# EAGLE design teensy_can (EAGLE 6.4)
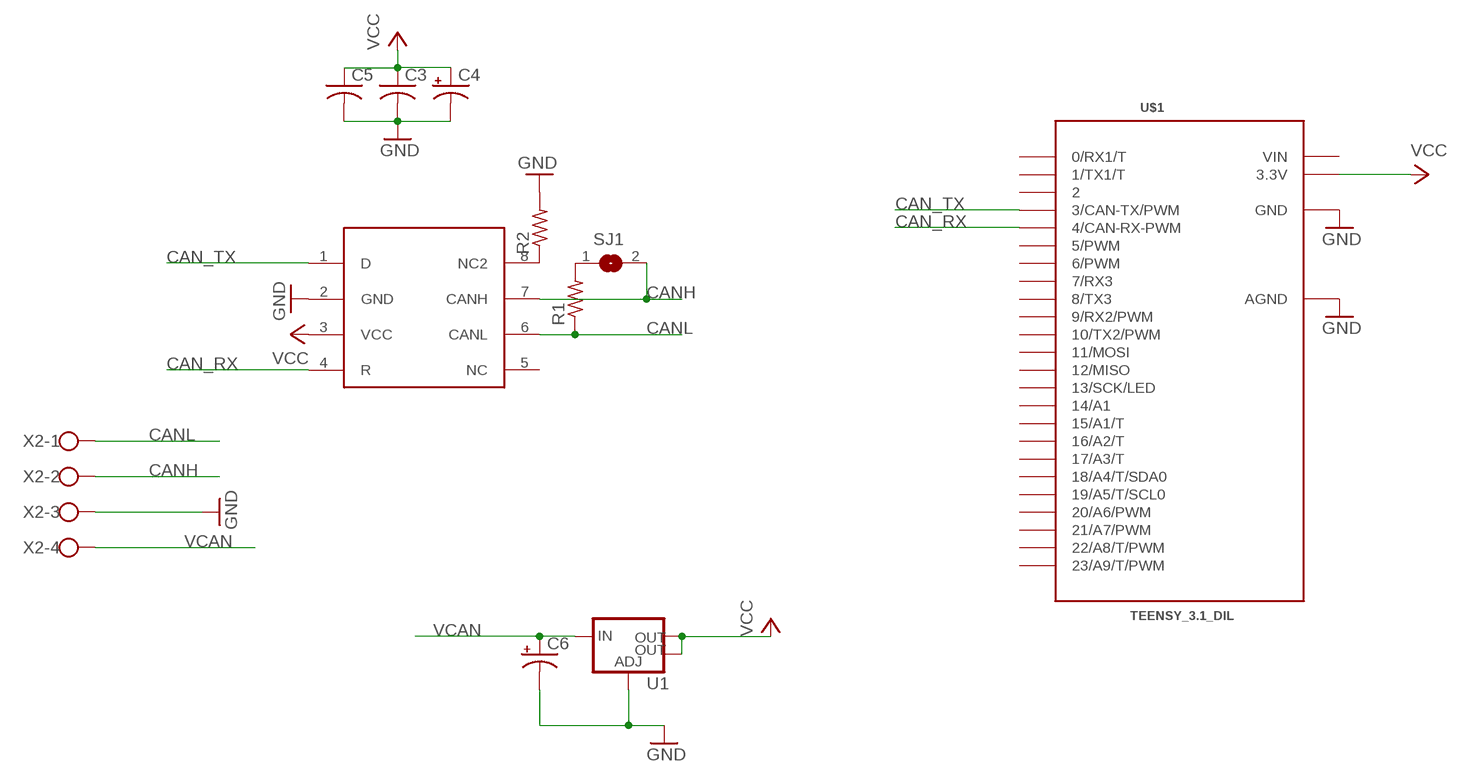
[diagram p0: schematic, sheet 1]

## Parts
C3  C-USC0805K  [C0805K]
C4  CPOL-USA/3216-18R  [A/3216-18R]
C5  C-USC0805K  [C0805K]
C6  CPOL-USA/3216-18R  [A/3216-18R]
R1  R-US_R0805  [R0805]
R2  R-US_R0805  [R0805]
SJ1  SJ  [SJ]
U1  V_REG_LM1117SOT223  [SOT223]
U$1  TEENSY_3.1_DIL  [TEENSY3-DIL]
U$2  SN65HVD232  [SO08-SKINNYPADS]
X2  W237-4  [W237-4]

## Nets
CAN_RX: U$1.4(4/CAN-RX-PWM) U$2.4(R)
CAN_TX: U$1.3(3/CAN-TX/PWM) U$2.1(D)
CANH: SJ1.2 U$2.7(CANH) X2.2
CANL: R1.1 U$2.6(CANL) X2.1
GND: C3.2 C4.- C5.2 C6.- R2.2 U1.1(ADJ) U$1.AGND U$1.GND U$2.2(GND) X2.3
N$1: R1.2 SJ1.1
N$3: R2.1 U$2.8(NC2)
VCAN: C6.+ U1.3(IN) X2.4
VCC: C3.1 C4.+ C5.1 U1.2(OUT) U1.4(OUT) U$1.3.3V U$2.3(VCC)
Unconnected: U$1.0(0/RX1/T) U$1.1(1/TX1/T) U$1.2 U$1.5(5/PWM) U$1.6(6/PWM) U$1.7(7/RX3) U$1.8(8/TX3) U$1.9(9/RX2/PWM) U$1.10(10/TX2/PWM) U$1.11(11/MOSI) U$1.12(12/MISO) U$1.13(13/SCK/LED) U$1.14/A0(14/A1) U$1.15/A1(15/A1/T) U$1.16/A2(16/A2/T) U$1.17/A3(17/A3/T) U$1.18/A4(18/A4/T/SDA0) U$1.19/A5(19/A5/T/SCL0) U$1.20/A6(20/A6/PWM) U$1.21/A7(21/A7/PWM) U$1.22/A8(22/A8/T/PWM) U$1.23/A9(23/A9/T/PWM) U$2.5(NC)

## Power pins joined to a net without a drawn wire
VIN: U$1.VIN

## Library data of the parts
C3 C5 = adafruit:C-US: CAPACITOR, American symbol
C4 C6 = adafruit:CPOL-US: POLARIZED CAPACITOR, American symbol
R1 R2 = adafruit:R-US_: RESISTOR, American symbol
SJ1 = jumper:SJ: SMD solder JUMPER
U1 = SparkFun-PowerIC:V_REG_LM1117: Voltage Regulator LM1117 Standard adjustable voltage regulator but in SMD form. Spark Fun Electronics SKU : COM-00595; PROD_ID: VREG-08170
U$1 = Teensy_3_and_LC_Series_Boards_v1.1:TEENSY_3.1_DIL: Teensy 3.1 or 3.2 in a DIL Layout.
U$2 = jpiat:SN65HVD232
X2 = con-wago-500:W237-4: WAGO SCREW CLAMP; OC_FARNELL: unknown; OC_NEWARK: unknown

## Board
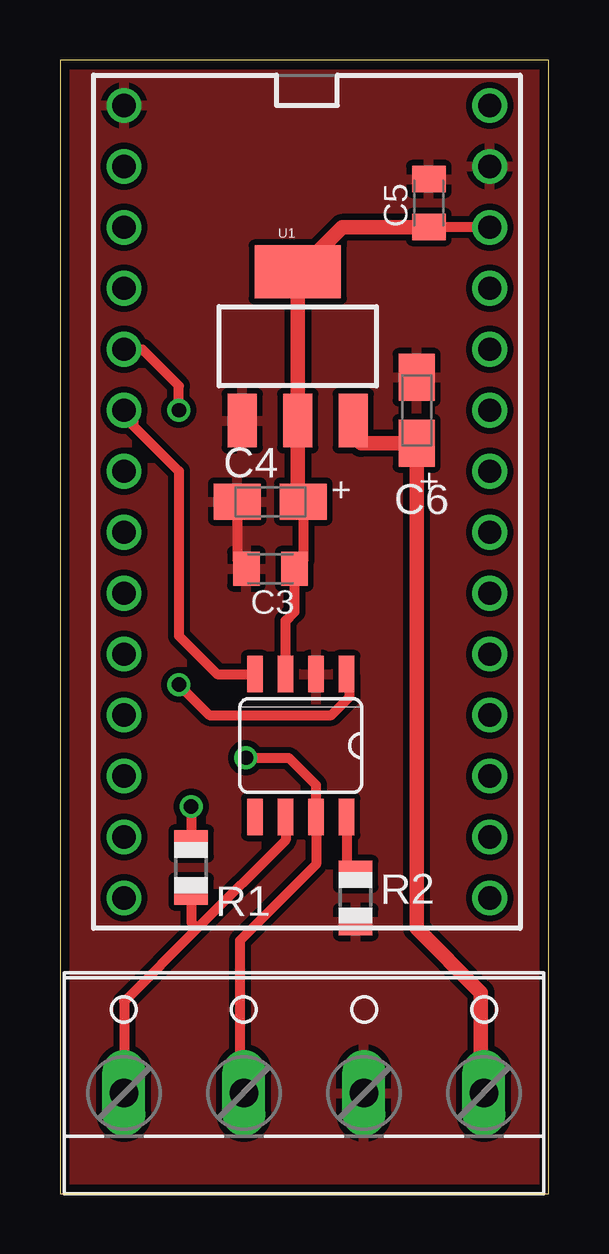
[diagram p1: board, top side]
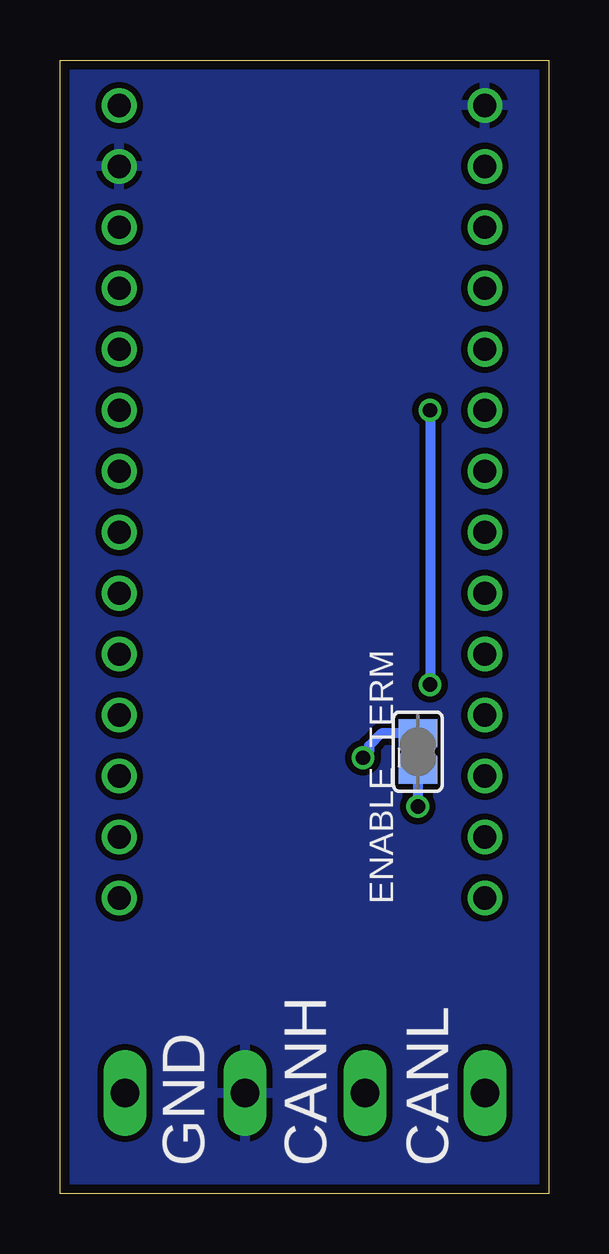
[diagram p2: board, bottom side, seen from below]

Size 20.37 x 47.23 mm. Coordinates in mm from the lower left corner, seen from the top.
Outline: 0,0 20.37,0 20.37,47.23 0,47.23 0,0
Copper layers (1*16): Top 0.0356mm / dielectric 1.5011mm / Bottom 0.0356mm
Design rules "LaenPCBOrder": minimum track width 6mil, minimum drill 13mil, track to track 6mil, track to pad 6mil, pad to pad 6mil, via to via 6mil, smd to smd 6mil, copper to edge 15mil, drill to drill 6mil, minimum pad ring 7mil, minimum via ring 7mil, stop-mask expansion 3mil, vias tented up to drill 0mil, thermal gap 10mil

### Footprints (pad centres in the part's own frame; a part is rotated, then mirrored left to right if it is on the bottom)
C0805K = smd 1.1 x 1.4: 1 -1,0; 2 1,0
A/3216-18R = smd 1.95 x 1.5: + 1.375,0; - -1.375,0
R0805 = smd 1.1 x 1.4: 1 -1,0; 2 1,0
SJ = smd 1.168 x 1.6: 1 -0.762,0; 2 0.762,0
SOT223 = smd 1.219 x 2.235: 1 -2.311,-3.099; 2 0,-3.099; 3 2.311,-3.099 | smd 3.6 x 2.2: 4 0,3.099
TEENSY3-DIL = drill 0.965: 0 -7.62,13.97; 1 -7.62,11.43; 2 -7.62,8.89; 3 -7.62,6.35; 3.3V 7.62,11.43; 4 -7.62,3.81; 5 -7.62,1.27; 6 -7.62,-1.27; 7 -7.62,-3.81; 8 -7.62,-6.35; 9 -7.62,-8.89; 10 -7.62,-11.43; 11 -7.62,-13.97; 12 -7.62,-16.51; 13 7.62,-16.51; 14/A0 7.62,-13.97; 15/A1 7.62,-11.43; 16/A2 7.62,-8.89; 17/A3 7.62,-6.35; 18/A4 7.62,-3.81; 19/A5 7.62,-1.27; 20/A6 7.62,1.27; 21/A7 7.62,3.81; 22/A8 7.62,6.35; 23/A9 7.62,8.89; AGND 7.62,13.97; GND -7.62,16.51; VIN 7.62,16.51
SO08-SKINNYPADS = smd 0.66 x 1.524: 1 -1.905,-2.973; 2 -0.635,-2.973; 3 0.635,-2.973; 4 1.905,-2.973; 5 1.905,2.973; 6 0.635,2.973; 7 -0.635,2.973; 8 -1.905,2.973
W237-4 = drill 1.194 long: 1 -7.5,-1.27; 2 -2.5,-1.27; 3 2.5,-1.27; 4 7.5,-1.27

### Placement (x,y rotation side)
C3  8.76,26.04 180 top
C4  8.76,28.83 0 top
C5  15.37,41.27 90 top
C6  14.86,32.64 270 top
R1  5.46,13.59 90 top
R2  12.32,12.32 270 top
SJ1  5.46,18.41 90 bottom
U1  9.91,35.31 0 top
U$1  10.29,28.83 0 top
U$2  10.03,18.67 180 top
X2  10.16,5.46 0 top

### Tracks (layer width: path | path; a pad name or v marks a point on that pad's centre or on a via)
CAN_RX
  Top 0.406: U$2.4 6.55,21.64 4.95,23.24 4.95,30.1 3.05,32 3.05,32.64 U$1.4
CAN_TX  (via drill 0.6)
  Top 0.406: v4.95,21.21 6.22,19.94 11.3,19.94 12.07,20.7 12.07,21.52 U$2.1 | U$1.3 3.43,35.18 4.95,33.66 v4.95,32.64
  Bottom 0.406: v4.95,32.64 v4.95,21.21
CANH  (via drill 0.6)
  Top 0.406: X2.2 7.49,4.74 7.49,10.54 10.67,13.72 U$2.7 10.67,17.02 9.53,18.16 v7.75,18.16
  Bottom 0.406: SJ1.2 6.98,19.18 7.49,18.67 7.49,18.41 v7.75,18.16
CANL
  Top 0.406: U$2.6 9.4,14.73 5.71,11.05 | R1.1 5.48,12.57 5.48,11.29 5.71,11.05 | 5.71,11.05 2.67,8 2.67,4.71 X2.1
GND
  Top 0.406: 7.77,29.21 C4.- 7.39,26.41 C3.2
  pour Top (isolate 0.254): -2.67,-1.14 -2.67,48.64 22.99,48.9 22.99,-0.89
  pour Bottom (isolate 0.254): 25.02,49.4 25.02,-1.91 -1.14,-1.91 -0.64,49.66
N$1  (via drill 0.6)
  Top 0.406: v5.46,16.13 R1.2
  Bottom 0.406: SJ1.1 v5.46,16.13
N$3
  Top 0.406: U$2.8 11.94,13.7 R2.1
VCAN
  Top 0.61: U1.3 12.22,31.6 12.55,31.26 C6.+ 14.86,11.05 17.53,8.38 17.53,4.83 X2.4
VCC
  Top 0.406: C4.+ 10.14,26.41 C3.1 9.76,24.24 9.4,23.88 U$2.3 | 17.4,40.26 U$1.3.3V 15.13,40.26 C5.1
  Top 0.61: 15.13,40.26 11.76,40.26 U1.4 U1.2 9.91,29.06 C4.+

### Text on the board
bPlace: ENABLE_TERM | CANL | CANH | GND